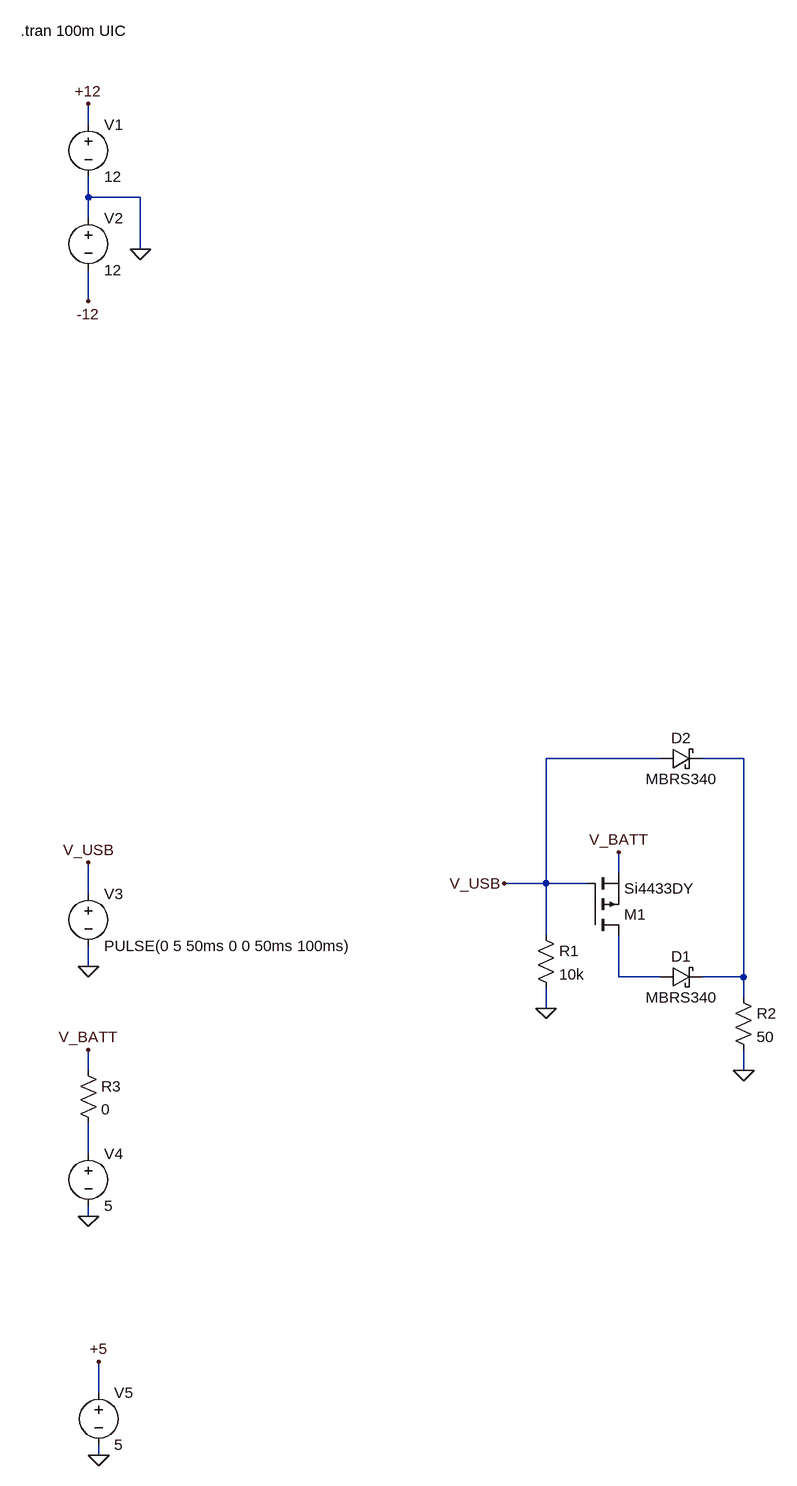
[diagram p0: schematic PwrSwitchSim.asc]
PwrSwitchSim.asc, the LTspice schematic file:
Version 4
SHEET 1 2852 3692
WIRE 64 256 64 224
WIRE 64 368 64 336
WIRE 144 368 64 368
WIRE 64 400 64 368
WIRE 144 448 144 368
WIRE 64 528 64 480
WIRE 944 1232 768 1232
WIRE 1072 1232 1008 1232
WIRE 880 1408 880 1376
WIRE 768 1424 768 1232
WIRE 768 1424 704 1424
WIRE 832 1424 768 1424
WIRE 64 1440 64 1392
WIRE 768 1504 768 1424
WIRE 64 1552 64 1520
WIRE 880 1568 880 1504
WIRE 944 1568 880 1568
WIRE 1072 1568 1072 1232
WIRE 1072 1568 1008 1568
WIRE 1072 1600 1072 1568
WIRE 768 1616 768 1584
WIRE 64 1712 64 1680
WIRE 1072 1712 1072 1680
WIRE 64 1840 64 1792
WIRE 64 1936 64 1920
WIRE 80 2208 80 2160
WIRE 80 2304 80 2288
FLAG 64 224 +12
FLAG 64 528 -12
FLAG 144 448 0
FLAG 64 1552 0
FLAG 64 1392 V_USB
FLAG 64 1936 0
FLAG 64 1680 V_BATT
FLAG 880 1376 V_BATT
FLAG 80 2304 0
FLAG 80 2160 +5
FLAG 704 1424 V_USB
FLAG 768 1616 0
FLAG 1072 1712 0
SYMBOL voltage 64 240 R0
SYMATTR InstName V1
SYMATTR Value 12
SYMBOL voltage 64 384 R0
SYMATTR InstName V2
SYMATTR Value 12
SYMBOL voltage 64 1424 R0
SYMATTR InstName V3
SYMATTR Value PULSE(0 5 50ms 0 0 50ms 100ms)
SYMBOL voltage 64 1824 R0
SYMATTR InstName V4
SYMATTR Value 5
SYMBOL res 48 1696 R0
SYMATTR InstName R3
SYMATTR Value 0
SYMBOL voltage 80 2192 R0
SYMATTR InstName V5
SYMATTR Value 5
SYMBOL res 752 1488 R0
SYMATTR InstName R1
SYMATTR Value 10k
SYMBOL pmos 832 1504 M180
SYMATTR InstName M1
SYMATTR Value Si4433DY
SYMBOL schottky 944 1584 R270
WINDOW 0 32 32 VTop 2
WINDOW 3 0 32 VBottom 2
SYMATTR InstName D1
SYMATTR Value MBRS340
SYMBOL schottky 944 1248 R270
WINDOW 0 32 32 VTop 2
WINDOW 3 0 32 VBottom 2
SYMATTR InstName D2
SYMATTR Value MBRS340
SYMBOL res 1056 1584 R0
SYMATTR InstName R2
SYMATTR Value 50
TEXT -40 112 Left 2 !.tran 100m UIC

The netlist it stands for:
* PwrSwitchSim.asc
V1 +12 0 12
V2 0 -12 12
V3 V_USB 0 PULSE(0 5 50ms 0 0 50ms 100ms)
V4 N003 0 5
R3 V_BATT N003 0
V5 +5 0 5
R1 V_USB 0 10k
M1 N002 V_USB V_BATT V_BATT Si4433DY
D1 N002 N001 MBRS340
D2 V_USB N001 MBRS340
R2 N001 0 50
.model D D
.lib standard.dio
.model NMOS NMOS
.model PMOS PMOS
.lib standard.mos
.tran 100m UIC
.backanno
.end